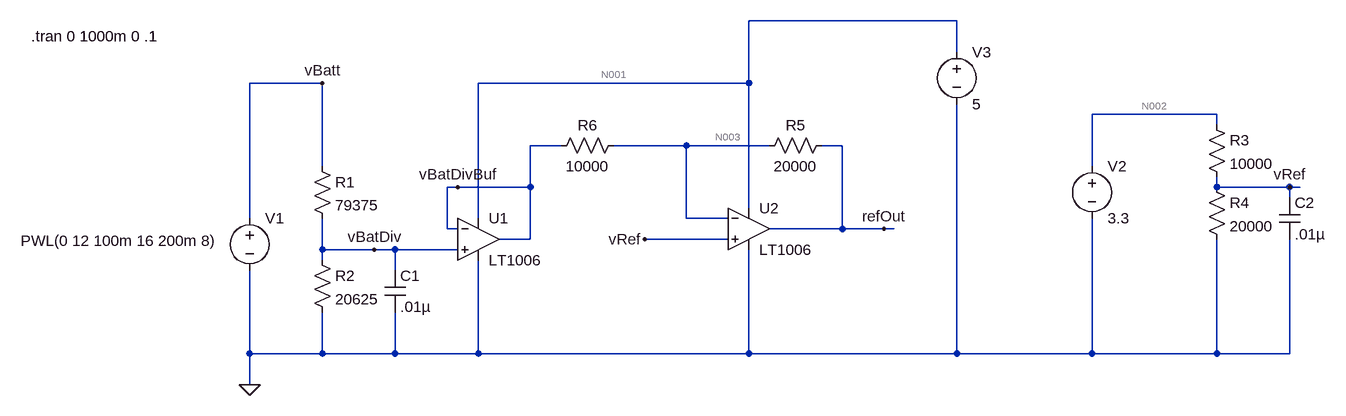
[diagram p0: schematic PrecisionBatteryMeasurement.asc]
PrecisionBatteryMeasurement.asc, the LTspice schematic file:
Version 4
SHEET 1 1724 680
WIRE 1136 -192 816 -192
WIRE 1136 -144 1136 -192
WIRE 160 -96 48 -96
WIRE 816 -96 816 -192
WIRE 816 -96 400 -96
WIRE 1536 -48 1344 -48
WIRE 1536 -32 1536 -48
WIRE 528 0 480 0
WIRE 720 0 608 0
WIRE 848 0 720 0
WIRE 960 0 928 0
WIRE 160 32 160 -96
WIRE 1344 32 1344 -48
WIRE 368 64 352 64
WIRE 480 64 480 0
WIRE 480 64 368 64
WIRE 1536 64 1536 48
WIRE 1648 64 1536 64
WIRE 1664 64 1648 64
WIRE 1648 80 1648 64
WIRE 816 96 816 -96
WIRE 48 112 48 -96
WIRE 400 112 400 -96
WIRE 720 112 720 0
WIRE 784 112 720 112
WIRE 352 128 352 64
WIRE 368 128 352 128
WIRE 960 128 960 0
WIRE 960 128 848 128
WIRE 1024 128 960 128
WIRE 1040 128 1024 128
WIRE 480 144 480 64
WIRE 480 144 432 144
WIRE 784 144 656 144
WIRE 160 160 160 112
WIRE 240 160 160 160
WIRE 272 160 240 160
WIRE 368 160 272 160
WIRE 160 176 160 160
WIRE 272 192 272 160
WIRE 48 320 48 192
WIRE 160 320 160 256
WIRE 160 320 48 320
WIRE 272 320 272 256
WIRE 272 320 160 320
WIRE 400 320 400 176
WIRE 400 320 272 320
WIRE 816 320 816 160
WIRE 816 320 400 320
WIRE 1136 320 1136 -64
WIRE 1136 320 816 320
WIRE 1344 320 1344 112
WIRE 1344 320 1136 320
WIRE 1536 320 1536 144
WIRE 1536 320 1344 320
WIRE 1648 320 1648 144
WIRE 1648 320 1536 320
WIRE 48 368 48 320
FLAG 48 368 0
FLAG 160 -96 vBatt
FLAG 656 144 vRef
FLAG 1648 64 vRef
FLAG 240 160 vBatDiv
FLAG 368 64 vBatDivBuf
FLAG 1024 128 refOut
SYMBOL voltage 48 96 R0
WINDOW 3 -352 50 Left 2
WINDOW 123 0 0 Left 2
WINDOW 39 0 0 Left 2
SYMATTR Value PWL(0 12 100m 16 200m 8)
SYMATTR InstName V1
SYMBOL res 144 16 R0
SYMATTR InstName R1
SYMATTR Value 79375
SYMATTR SpiceLine tol=.1 pwr=.1
SYMBOL res 144 160 R0
SYMATTR InstName R2
SYMATTR Value 20625
SYMATTR SpiceLine tol=.1 pwr=.1
SYMBOL cap 256 192 R0
SYMATTR InstName C1
SYMATTR Value .01µ
SYMATTR SpiceLine V=50
SYMBOL voltage 1344 16 R0
WINDOW 123 0 0 Left 2
WINDOW 39 0 0 Left 2
SYMATTR InstName V2
SYMATTR Value 3.3
SYMBOL res 1520 -48 R0
SYMATTR InstName R3
SYMATTR Value 10000
SYMATTR SpiceLine tol=1 pwr=.1
SYMBOL res 1520 48 R0
SYMATTR InstName R4
SYMATTR Value 20000
SYMATTR SpiceLine tol=1 pwr=.1
SYMBOL res 944 -16 R90
WINDOW 0 0 56 VBottom 2
WINDOW 3 32 56 VTop 2
SYMATTR InstName R5
SYMATTR Value 20000
SYMBOL res 624 -16 R90
WINDOW 0 0 56 VBottom 2
WINDOW 3 32 56 VTop 2
SYMATTR InstName R6
SYMATTR Value 10000
SYMBOL Opamps\\LT1006 400 80 R0
SYMATTR InstName U1
SYMBOL Opamps\\LT1006 816 64 R0
SYMATTR InstName U2
SYMBOL voltage 1136 -160 R0
WINDOW 123 0 0 Left 2
WINDOW 39 0 0 Left 2
SYMATTR InstName V3
SYMATTR Value 5
SYMBOL cap 1632 80 R0
SYMATTR InstName C2
SYMATTR Value .01µ
TEXT -288 -168 Left 2 !.tran 0 1000m 0 .1

The netlist it stands for:
* PrecisionBatteryMeasurement.asc
V1 vBatt 0 PWL(0 12 100m 16 200m 8)
R1 vBatt vBatDiv 79375 tol=.1 pwr=.1
R2 vBatDiv 0 20625 tol=.1 pwr=.1
C1 vBatDiv 0 .01µ V=50
V2 N002 0 3.3
R3 N002 vRef 10000 tol=1 pwr=.1
R4 vRef 0 20000 tol=1 pwr=.1
R5 refOut N003 20000
R6 N003 vBatDivBuf 10000
XU1 vBatDiv vBatDivBuf N001 0 vBatDivBuf LT1006  ; pins In+ In- V+ V- OUT
XU2 vRef N003 N001 0 refOut LT1006  ; pins In+ In- V+ V- OUT
V3 N001 0 5
C2 vRef 0 .01µ
.tran 0 1000m 0 .1
.lib LTC.lib
.backanno
.end

* Results of the author's LTspice run, read from the files saved beside the schematic
* Operating Point, zero values left out:
*   V(vbatt) = 12 V
*   V(vbatdiv) = 2.475 V
*   V(n002) = 3.3 V
*   V(vref) = 2.2 V
*   V(refout) = 1.65 V
*   V(n003) = 2.2 V
*   V(vbatdivbuf) = 2.475 V
*   V(n001) = 5 V
*   I(R6) = -27.51 µA
*   I(R5) = -27.52 µA
*   I(R4) = 110 µA
*   I(R3) = 110 µA
*   I(R2) = 120 µA
*   I(R1) = 120 µA
*   I(V3) = -720.3 µA
*   I(V2) = -110 µA
*   I(V1) = -120 µA
*   Ix(u1:1) = -8.805 nA
*   Ix(u1:2) = -8.805 nA
*   Ix(u1:3) = 373.9 µA
*   Ix(u1:4) = -346.4 µA
*   Ix(u1:5) = -27.5 µA
*   Ix(u2:1) = -8.833 nA
*   Ix(u2:2) = -8.833 nA
*   Ix(u2:3) = 346.4 µA
*   Ix(u2:4) = -373.9 µA
*   Ix(u2:5) = 27.52 µA
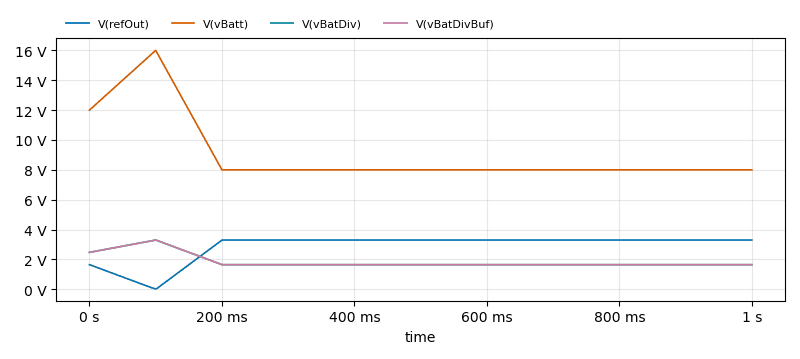
[diagram p1: Transient Analysis of PrecisionBatteryMeasurement.asc, plotted from the saved traces]
* Transient Analysis, 1 run:
*   V(refOut): min 34.58 mV, max 3.3 V, average 2.887 V, rms 3.038 V, last 3.3 V
*   V(vBatt): min 8 V, max 16 V, average 9 V, rms 9.287 V, last 8 V
*   V(vBatDiv): min 1.65 V, max 3.299 V, average 1.857 V, rms 1.916 V, last 1.65 V
*   V(vBatDivBuf): min 1.65 V, max 3.299 V, average 1.857 V, rms 1.916 V, last 1.65 V